# Altium schematic sheet Microcrontroller.SchDoc: FHGR_A3_landscape
size A2; Date: 18.07.2017; DrawnBy: G.P. Catregn; Organization: HTW Chur; Address1: Pulvermühlestrasse 57; Address2: 7004 Chur; Address3: Switzerland; DocumentNumber: 1; Revision: V1.0; SheetNumber: 2; SheetTotal: 2; DocumentName: HTW Template
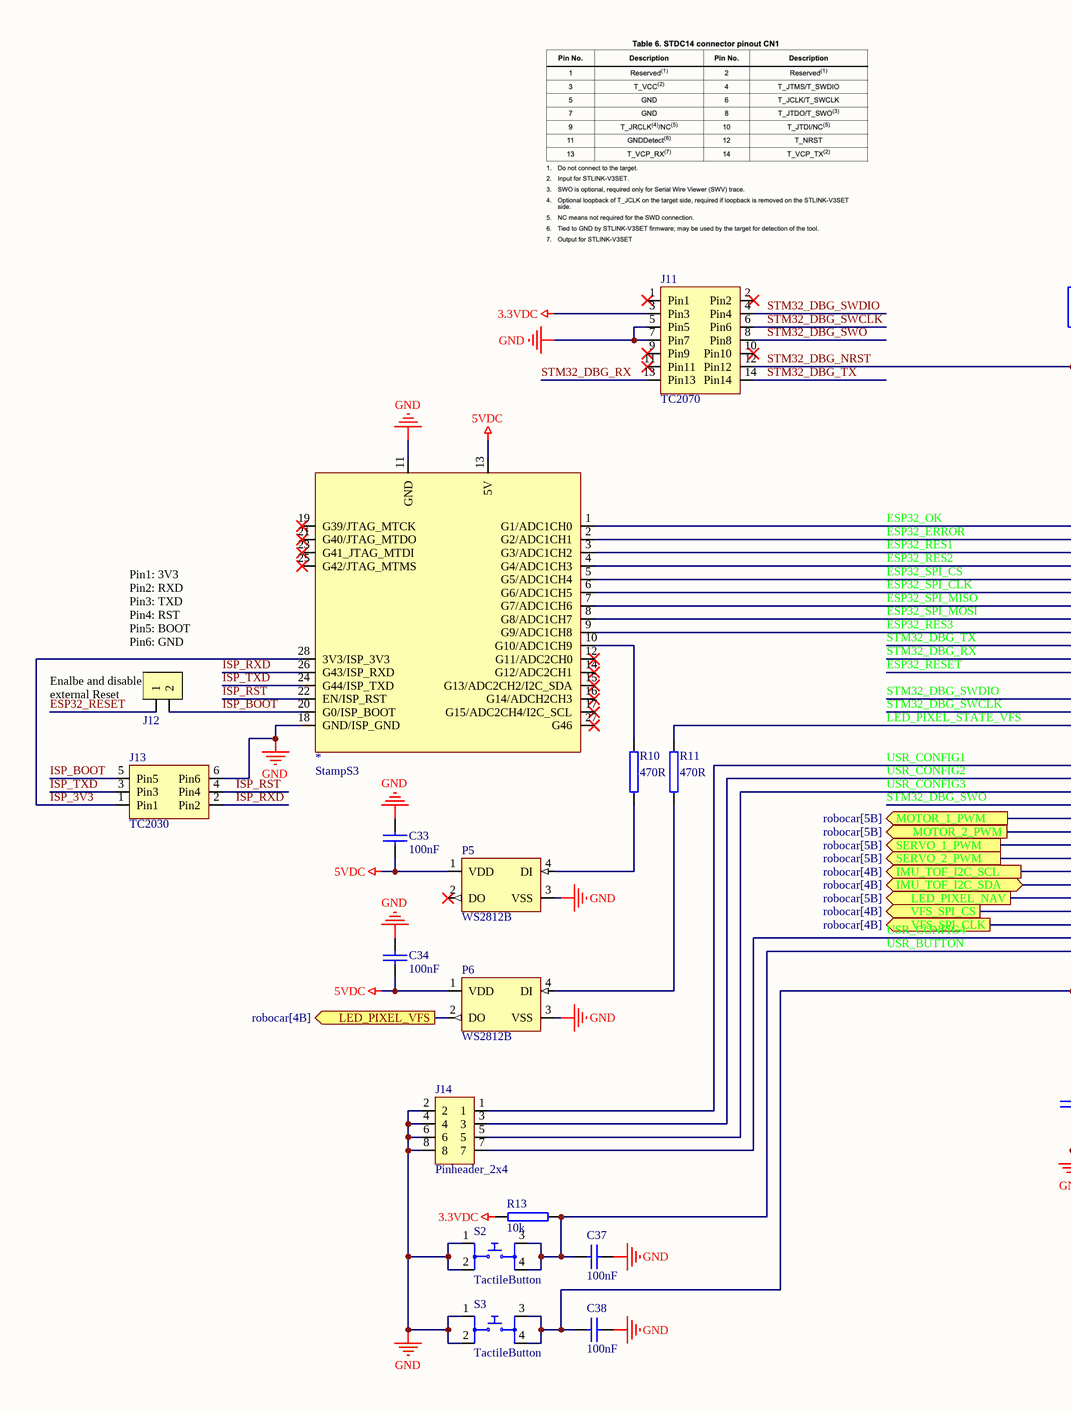
[diagram p0: Microcrontroller.SchDoc, left]
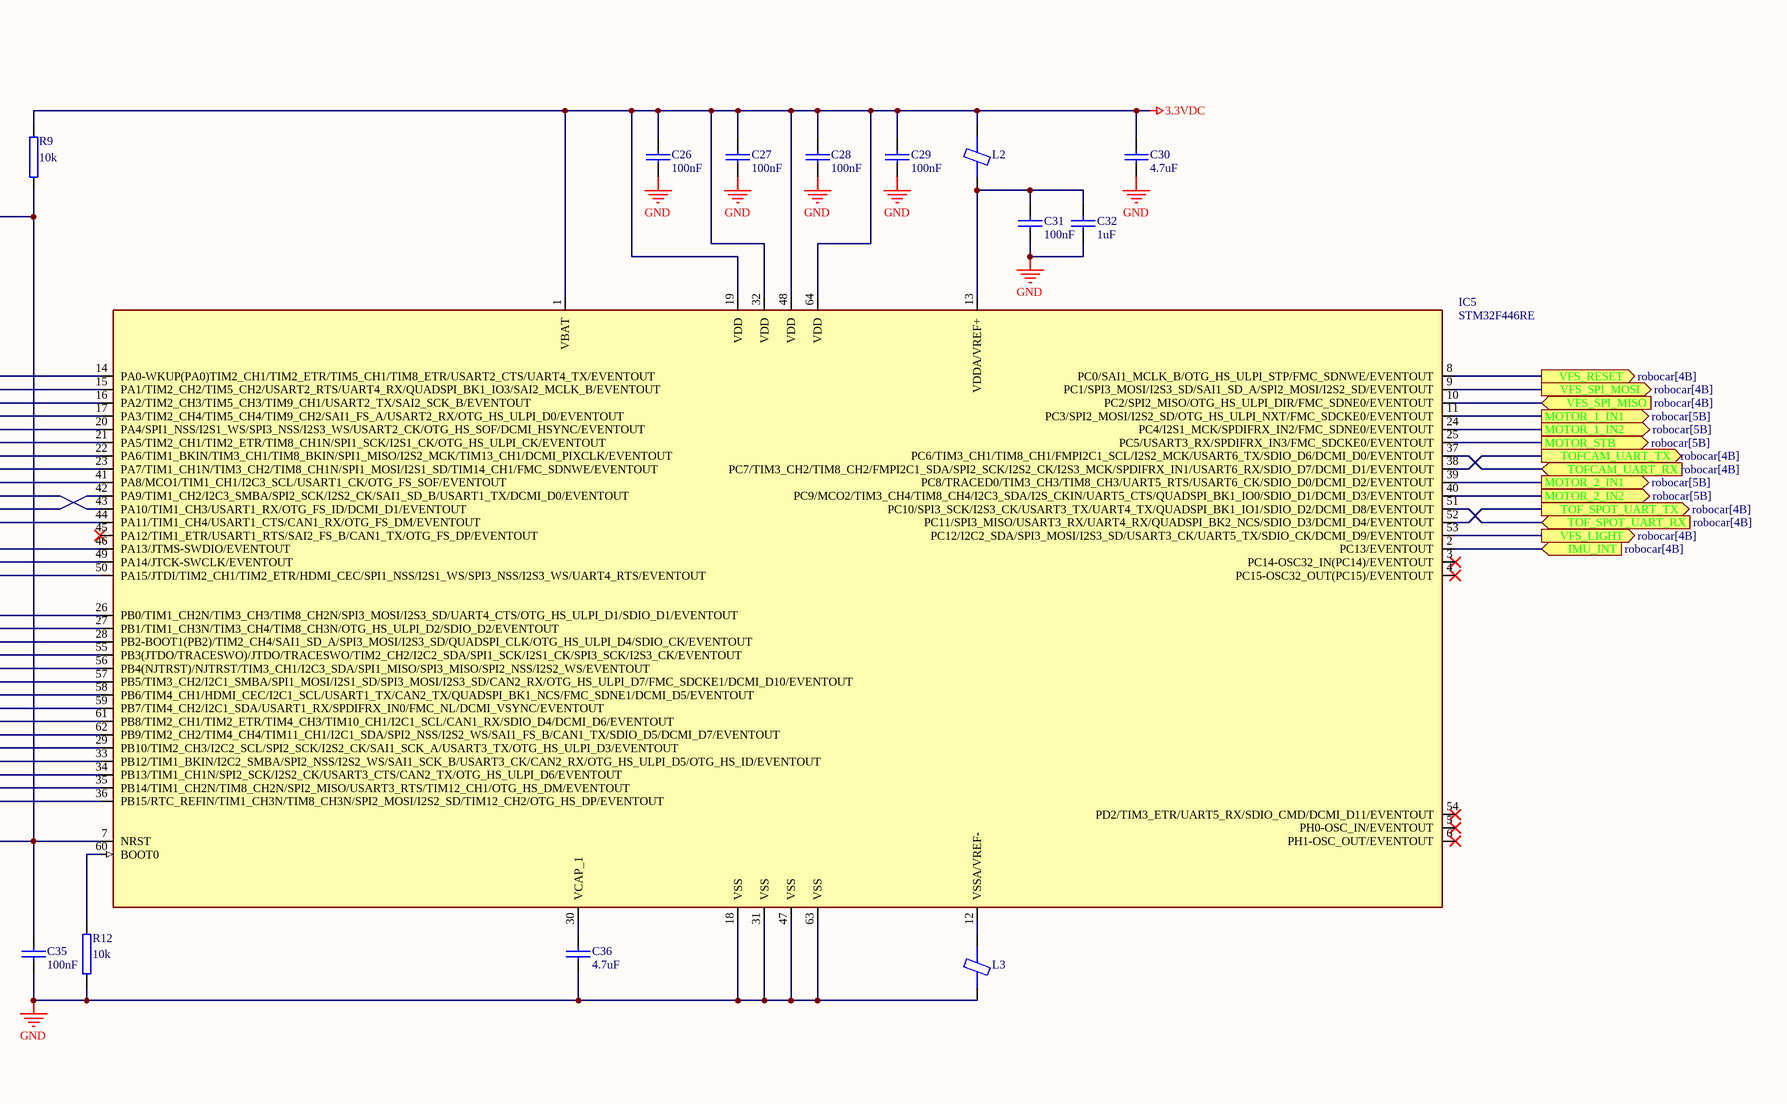
[diagram p1: Microcrontroller.SchDoc, right]

## Parts
*  StampS3  [Stamp-S3-SMD]
C26  value 100nF  [0603]  (hidden comment: C 100nF 0603)
C27  value 100nF  [0603]  (hidden comment: C 100nF 0603)
C28  value 100nF  [0603]  (hidden comment: C 100nF 0603)
C29  value 100nF  [0603]  (hidden comment: C 100nF 0603)
C30  value 4.7uF  [0603]  (hidden comment: C 4.7uF 0603)
C31  value 100nF  [0603]  (hidden comment: C 100nF 0603)
C32  value 1uF  [0603]  (hidden comment: C 1uF 0603)
C33  value 100nF  [0603]  (hidden comment: C 100nF 0603)
C34  value 100nF  [0603]  (hidden comment: C 100nF 0603)
C35  value 100nF  [0603]  (hidden comment: C 100nF 0603)
C36  value 4.7uF  [0603]  (hidden comment: C 4.7uF 0603)
C37  value 100nF  [0603]  (hidden comment: C 100nF 0603)
C38  value 100nF  [0603]  (hidden comment: C 100nF 0603)
IC5  STM32F446RE  [STM32F446RET6]
J11  TC2070  [TC2070]
J12  2Pin_Male  [Header1x2_254]  (value not drawn)
J13  TC2030  [TC2030]
J14  Pinheader_2x4  [61300821121]
L2  L Ferrit Bead  [0805]  (value not drawn)
L3  L Ferrit Bead  [0805]  (value not drawn)
P5  WS2812B  [WS2812B_SMD]
P6  WS2812B  [WS2812B_SMD]
R9  value 10k  [0805]  (hidden comment: R 10K 0805)
R10  value 470R  [0805]  (hidden comment: R 220R 0805)
R11  value 470R  [0805]  (hidden comment: R 220R 0805)
R12  value 10k  [0805]  (hidden comment: R 10K 0805)
R13  value 10k  [0805]  (hidden comment: R 10K 0805)
S2  TactileButton  [TactileButton-6x6mm]
S3  TactileButton  [TactileButton-6x6mm]

## Ports
IMU_INT (in, see robocar[4B]), IMU_TOF_I2C_SCL (out, see robocar[4B]), IMU_TOF_I2C_SDA (bidir, see robocar[4B]), LED_PIXEL_NAV (out, see robocar[5B]), LED_PIXEL_VFS (out, see robocar[4B]), MOTOR_1_IN1 (out, see robocar[5B]), MOTOR_1_IN2 (out, see robocar[5B]), MOTOR_1_PWM (out, see robocar[5B]), MOTOR_2_IN1 (out, see robocar[5B]), MOTOR_2_IN2 (out, see robocar[5B]), MOTOR_2_PWM (out, see robocar[5B]), MOTOR_STB (out, see robocar[5B]), SERVO_1_PWM (out, see robocar[5B]), SERVO_2_PWM (out, see robocar[5B]), TOF_SPOT_UART_RX (in, see robocar[4B]), TOF_SPOT_UART_TX (out, see robocar[4B]), TOFCAM_UART_RX (in, see robocar[4B]), TOFCAM_UART_TX (out, see robocar[4B]), VFS_LIGHT (out, see robocar[4B]), VFS_RESET (out, see robocar[4B]), VFS_SPI_CLK (out, see robocar[4B]), VFS_SPI_CS (out, see robocar[4B]), VFS_SPI_MISO (in, see robocar[4B]), VFS_SPI_MOSI (out, see robocar[4B])

## Nets
3.3VDC: C26.1 C27.1 C28.1 C29.1 C30.1 IC5.1(VBAT) IC5.19(VDD) IC5.32(VDD) IC5.48(VDD) IC5.64(VDD) J11.3(Pin3) L2.2 R9.2 R13.2
5VDC: *.13(5V) C33.1 C34.1 P5.1(VDD) P6.1(VDD)
GND: *.11(GND) *.18(GND/ISP_GND) C26.2 C27.2 C28.2 C29.2 C30.2 C31.2 C32.2 C33.2 C34.2 C35.2 C36.2 C37.1 C38.1 IC5.18(VSS) IC5.31(VSS) IC5.47(VSS) IC5.63(VSS) J11.5(Pin5) J11.7(Pin7) J13.6(Pin6) J14.2 J14.4 J14.6 J14.8 L3.2 P5.3(VSS) P6.3(VSS) R12.2 S2.1 S2.2 S3.1 S3.2
ESP32_ERROR: *.2(G2/ADC1CH1) IC5.15(PA1/TIM2_CH2/TIM5_CH2/USART2_RTS/UART4_RX/QUADSPI_BK1_IO3/SAI2_MCLK_B/EVENTOUT)
ESP32_OK: *.1(G1/ADC1CH0) IC5.14(PA0-WKUP(PA0)TIM2_CH1/TIM2_ETR/TIM5_CH1/TIM8_ETR/USART2_CTS/UART4_TX/EVENTOUT)
ESP32_RES1: *.3(G3/ADC1CH2) IC5.16(PA2/TIM2_CH3/TIM5_CH3/TIM9_CH1/USART2_TX/SAI2_SCK_B/EVENTOUT)
ESP32_RES2: *.4(G4/ADC1CH3) IC5.17(PA3/TIM2_CH4/TIM5_CH4/TIM9_CH2/SAI1_FS_A/USART2_RX/OTG_HS_ULPI_D0/EVENTOUT)
ESP32_RES3: *.9(G9/ADC1CH8) IC5.41(PA8/MCO1/TIM1_CH1/I2C3_SCL/USART1_CK/OTG_FS_SOF/EVENTOUT)
ESP32_RESET: IC5.44(PA11/TIM1_CH4/USART1_CTS/CAN1_RX/OTG_FS_DM/EVENTOUT) J12.1
ESP32_SPI_CLK: *.6(G6/ADC1CH5) IC5.21(PA5/TIM2_CH1/TIM2_ETR/TIM8_CH1N/SPI1_SCK/I2S1_CK/OTG_HS_ULPI_CK/EVENTOUT)
ESP32_SPI_CS: *.5(G5/ADC1CH4) IC5.20(PA4/SPI1_NSS/I2S1_WS/SPI3_NSS/I2S3_WS/USART2_CK/OTG_HS_SOF/DCMI_HSYNC/EVENTOUT)
ESP32_SPI_MISO: *.7(G7/ADC1CH6) IC5.22(PA6/TIM1_BKIN/TIM3_CH1/TIM8_BKIN/SPI1_MISO/I2S2_MCK/TIM13_CH1/DCMI_PIXCLK/EVENTOUT)
ESP32_SPI_MOSI: *.8(G8/ADC1CH7) IC5.23(PA7/TIM1_CH1N/TIM3_CH2/TIM8_CH1N/SPI1_MOSI/I2S1_SD/TIM14_CH1/FMC_SDNWE/EVENTOUT)
IMU_INT: IC5.2(PC13/EVENTOUT) ; port IMU_INT
IMU_TOF_I2C_SCL: IC5.61(PB8/TIM2_CH1/TIM2_ETR/TIM4_CH3/TIM10_CH1/I2C1_SCL/CAN1_RX/SDIO_D4/DCMI_D6/EVENTOUT) ; port IMU_TOF_I2C_SCL
IMU_TOF_I2C_SDA: IC5.62(PB9/TIM2_CH2/TIM4_CH4/TIM11_CH1/I2C1_SDA/SPI2_NSS/I2S2_WS/SAI1_FS_B/CAN1_TX/SDIO_D5/DCMI_D7/EVENTOUT) ; port IMU_TOF_I2C_SDA
ISP_3V3: *.28(3V3/ISP_3V3) J13.1(Pin1)
ISP_BOOT: *.20(G0/ISP_BOOT) J12.2 J13.5(Pin5)
ISP_RST: *.22(EN/ISP_RST) J13.4(Pin4)
ISP_RXD: *.26(G43/ISP_RXD) J13.2(Pin2)
ISP_TXD: *.24(G44/ISP_TXD) J13.3(Pin3)
LED_PIXEL_NAV: IC5.29(PB10/TIM2_CH3/I2C2_SCL/SPI2_SCK/I2S2_CK/SAI1_SCK_A/USART3_TX/OTG_HS_ULPI_D3/EVENTOUT) ; port LED_PIXEL_NAV
LED_PIXEL_STATE_VFS: IC5.50(PA15/JTDI/TIM2_CH1/TIM2_ETR/HDMI_CEC/SPI1_NSS/I2S1_WS/SPI3_NSS/I2S3_WS/UART4_RTS/EVENTOUT) R11.2
LED_PIXEL_VFS: P6.2(DO) ; port LED_PIXEL_VFS
MOTOR_1_IN1: IC5.11(PC3/SPI2_MOSI/I2S2_SD/OTG_HS_ULPI_NXT/FMC_SDCKE0/EVENTOUT) ; port MOTOR_1_IN1
MOTOR_1_IN2: IC5.24(PC4/I2S1_MCK/SPDIFRX_IN2/FMC_SDNE0/EVENTOUT) ; port MOTOR_1_IN2
MOTOR_1_PWM: IC5.56(PB4(NJTRST)/NJTRST/TIM3_CH1/I2C3_SDA/SPI1_MISO/SPI3_MISO/SPI2_NSS/I2S2_WS/EVENTOUT) ; port MOTOR_1_PWM
MOTOR_2_IN1: IC5.39(PC8/TRACED0/TIM3_CH3/TIM8_CH3/UART5_RTS/USART6_CK/SDIO_D0/DCMI_D2/EVENTOUT) ; port MOTOR_2_IN1
MOTOR_2_IN2: IC5.40(PC9/MCO2/TIM3_CH4/TIM8_CH4/I2C3_SDA/I2S_CKIN/UART5_CTS/QUADSPI_BK1_IO0/SDIO_D1/DCMI_D3/EVENTOUT) ; port MOTOR_2_IN2
MOTOR_2_PWM: IC5.57(PB5/TIM3_CH2/I2C1_SMBA/SPI1_MOSI/I2S1_SD/SPI3_MOSI/I2S3_SD/CAN2_RX/OTG_HS_ULPI_D7/FMC_SDCKE1/DCMI_D10/EVENTOUT) ; port MOTOR_2_PWM
MOTOR_STB: IC5.25(PC5/USART3_RX/SPDIFRX_IN3/FMC_SDCKE0/EVENTOUT) ; port MOTOR_STB
SERVO_1_PWM: IC5.58(PB6/TIM4_CH1/HDMI_CEC/I2C1_SCL/USART1_TX/CAN2_TX/QUADSPI_BK1_NCS/FMC_SDNE1/DCMI_D5/EVENTOUT) ; port SERVO_1_PWM
SERVO_2_PWM: IC5.59(PB7/TIM4_CH2/I2C1_SDA/USART1_RX/SPDIFRX_IN0/FMC_NL/DCMI_VSYNC/EVENTOUT) ; port SERVO_2_PWM
STM32_DBG_NRST: C35.1 C38.2 IC5.7(NRST) J11.12(Pin12) R9.1 S3.3 S3.4
STM32_DBG_RX: IC5.42(PA9/TIM1_CH2/I2C3_SMBA/SPI2_SCK/I2S2_CK/SAI1_SD_B/USART1_TX/DCMI_D0/EVENTOUT) J11.13(Pin13)
STM32_DBG_SWCLK: IC5.49(PA14/JTCK-SWCLK/EVENTOUT) J11.6(Pin6)
STM32_DBG_SWDIO: IC5.46(PA13/JTMS-SWDIO/EVENTOUT) J11.4(Pin4)
STM32_DBG_SWO: IC5.55(PB3(JTDO/TRACESWO)/JTDO/TRACESWO/TIM2_CH2/I2C2_SDA/SPI1_SCK/I2S1_CK/SPI3_SCK/I2S3_CK/EVENTOUT) J11.8(Pin8)
STM32_DBG_TX: IC5.43(PA10/TIM1_CH3/USART1_RX/OTG_FS_ID/DCMI_D1/EVENTOUT) J11.14(Pin14)
TOF_SPOT_UART_RX: IC5.51(PC10/SPI3_SCK/I2S3_CK/USART3_TX/UART4_TX/QUADSPI_BK1_IO1/SDIO_D2/DCMI_D8/EVENTOUT) ; port TOF_SPOT_UART_RX
TOF_SPOT_UART_TX: IC5.52(PC11/SPI3_MISO/USART3_RX/UART4_RX/QUADSPI_BK2_NCS/SDIO_D3/DCMI_D4/EVENTOUT) ; port TOF_SPOT_UART_TX
TOFCAM_UART_RX: IC5.37(PC6/TIM3_CH1/TIM8_CH1/FMPI2C1_SCL/I2S2_MCK/USART6_TX/SDIO_D6/DCMI_D0/EVENTOUT) ; port TOFCAM_UART_RX
TOFCAM_UART_TX: IC5.38(PC7/TIM3_CH2/TIM8_CH2/FMPI2C1_SDA/SPI2_SCK/I2S2_CK/I2S3_MCK/SPDIFRX_IN1/USART6_RX/SDIO_D7/DCMI_D1/EVENTOUT) ; port TOFCAM_UART_TX
USR_BUTTON: C37.2 IC5.36(PB15/RTC_REFIN/TIM1_CH3N/TIM8_CH3N/SPI2_MOSI/I2S2_SD/TIM12_CH2/OTG_HS_DP/EVENTOUT) R13.1 S2.3 S2.4
USR_CONFIG1: IC5.26(PB0/TIM1_CH2N/TIM3_CH3/TIM8_CH2N/SPI3_MOSI/I2S3_SD/UART4_CTS/OTG_HS_ULPI_D1/SDIO_D1/EVENTOUT) J14.1
USR_CONFIG2: IC5.27(PB1/TIM1_CH3N/TIM3_CH4/TIM8_CH3N/OTG_HS_ULPI_D2/SDIO_D2/EVENTOUT) J14.3
USR_CONFIG3: IC5.28(PB2-BOOT1(PB2)/TIM2_CH4/SAI1_SD_A/SPI3_MOSI/I2S3_SD/QUADSPI_CLK/OTG_HS_ULPI_D4/SDIO_CK/EVENTOUT) J14.5
USR_CONFIG4: IC5.35(PB14/TIM1_CH2N/TIM8_CH2N/SPI2_MISO/USART3_RTS/TIM12_CH1/OTG_HS_DM/EVENTOUT) J14.7
VFS_LIGHT: IC5.53(PC12/I2C2_SDA/SPI3_MOSI/I2S3_SD/USART3_CK/UART5_TX/SDIO_CK/DCMI_D9/EVENTOUT) ; port VFS_LIGHT
VFS_RESET: IC5.8(PC0/SAI1_MCLK_B/OTG_HS_ULPI_STP/FMC_SDNWE/EVENTOUT) ; port VFS_RESET
VFS_SPI_CLK: IC5.34(PB13/TIM1_CH1N/SPI2_SCK/I2S2_CK/USART3_CTS/CAN2_TX/OTG_HS_ULPI_D6/EVENTOUT) ; port VFS_SPI_CLK
VFS_SPI_CS: IC5.33(PB12/TIM1_BKIN/I2C2_SMBA/SPI2_NSS/I2S2_WS/SAI1_SCK_B/USART3_CK/CAN2_RX/OTG_HS_ULPI_D5/OTG_HS_ID/EVENTOUT) ; port VFS_SPI_CS
VFS_SPI_MISO: IC5.10(PC2/SPI2_MISO/OTG_HS_ULPI_DIR/FMC_SDNE0/EVENTOUT) ; port VFS_SPI_MISO
VFS_SPI_MOSI: IC5.9(PC1/SPI3_MOSI/I2S3_SD/SAI1_SD_A/SPI2_MOSI/I2S2_SD/EVENTOUT) ; port VFS_SPI_MOSI
Net*_10: *.10(G10/ADC1CH9) R10.2
NetC31_1: C31.1 C32.1 IC5.13(VDDA/VREF+) L2.1
NetC36_1: C36.1 IC5.30(VCAP_1)
NetIC5_12: IC5.12(VSSA/VREF-) L3.1
NetIC5_60: IC5.60(BOOT0) R12.1
NetP5_4: P5.4(DI) R10.1
NetP6_4: P6.4(DI) R11.1

Not connected (* = marked no-connect by the designer): * 12(G11/ADC2CH0)* 14(G12/ADC2CH1)* 15(G13/ADC2CH2/I2C_SDA)* 16(G14/ADCH2CH3)* 17(G15/ADC2CH4/I2C_SCL)* 19(G39/JTAG_MTCK)* 21(G40/JTAG_MTDO)* 23(G41_JTAG_MTDI)* 25(G42/JTAG_MTMS)* 27(G46)*; IC5 3(PC14-OSC32_IN(PC14)/EVENTOUT)* 4(PC15-OSC32_OUT(PC15)/EVENTOUT)* 5(PH0-OSC_IN/EVENTOUT)* 6(PH1-OSC_OUT/EVENTOUT)* 45(PA12/TIM1_ETR/USART1_RTS/SAI2_FS_B/CAN1_TX/OTG_FS_DP/EVENTOUT)* 54(PD2/TIM3_ETR/UART5_RX/SDIO_CMD/DCMI_D11/EVENTOUT)*; J11 1(Pin1)* 2(Pin2)* 9(Pin9)* 10(Pin10)* 11(Pin11)*; P5 2(DO)*

## Notes on the sheet
- (near J12) Pin1: 3V3
  Pin2: RXD
  Pin3: TXD
  Pin4: RST
  Pin5: BOOT
  Pin6: GND
- (near J12) Enalbe and disable external Reset
- Drawn by:
- Title:
- Date:
- File:
- Sheet
- of
- Size:
- Revision:
- A2

## Library data of the parts
C26-C29 C31 C33-C35 C37 C38 = C_100nF_0603: TempKoeff: Y5V; Tolerance: -20%/+80%; Voltage: 50V; Part ID: C_100nF_0603; Price 1pc (CHF): 0.1; Supplier 1: Digi-Key; Supplier Part Number 1: 1276-1012-1-ND
C30 C36 = C_4_7uF_0603: TempKoeff: X5R; Tolerance: 10%; Voltage: 6.3V; Part ID: C_4_7uF_0603; Price 1pc (CHF): 0.1; Supplier 1: Digi-Key; Supplier Part Number 1: 1276-1045-1-ND
C32 = C_1uF_0603: TempKoeff: X7R; Tolerance: 10%; Voltage: 25V; Part ID: C_1uF_0603; Price 1pc (CHF): 0.29; Supplier 1: Digi-Key; Supplier Part Number 1: 1276-6617-1-ND
J12 = Header_2: Part ID: Header_2; Price 1pc (CHF): 0.13; Supplier 1: Digi-Key; ComponentLink1Description: Datasheet; ComponentLink1URL: https://katalog.we-online.de/em/datasheet/6130xx11121.pdf; Supplier Part Number 1: 732-5315-ND
L2 L3 = L_Ferrit_Bead: VALUE: 600Ohm @ 100MHz; Current: 2A; Part ID: L_Ferrit_Bead; Price 1pc (CHF): 0.22; Supplier 1: Digi-Key; ComponentLink1URL: https://katalog.we-online.de/pbs/datasheet/742792040.pdf; ComponentLink1Description: Datasheet; Supplier Part Number 1: 732-1620-1-ND
R9 R12 R13 = R_10k_0805: Tolerance: 1%; Power Dissipation: 125mW; Part ID: R_10k_0805; Price 10pcs (CHF): 0.021; Supplier 1: Digi-Key; Supplier Part Number 1: 311-10.0KCRCT-ND
R10 R11 = R_220R_0805: Tolerance: 1%; Power Dissipation: 125mW; Part ID: R_220R_0805; Price 10pcs (CHF): 0.052; Supplier 1: Digi-Key; Supplier Part Number 1: A129741CT-ND
S2 S3 = TactileButton: Voltage: 12V; Current: 50mA; Part ID: TactileButton; Price 1pc (CHF): 0.59; Dimension: 6.2mmx6.2mmx4.3mm; Supplier 1: Digi-Key; ComponentLink1Description: Datasheet; ComponentLink1URL: https://media.digikey.com/pdf/Data%20Sheets/APEM%20Components%20PDFs/ADTS6,%20ADTSM,%20AKTSC6%20Series.pdf; Supplier Part Number 1: 679-2380-1-ND
IC5 = STM32F446RE: Supplier 1: Mouser; Supplier Part Number 1: 511-STM32F446RET6
J14 = Pinheader_2x4: Supplier 1: Rs; Supplier Part Number 1: 8281522P
P5 P6 = WS2812B: ComponentLink1Description: Datasheet; ComponentLink1URL: http://cdn.sparkfun.com/datasheets/BreakoutBoards/WS2812B.pdf